# Altium schematic sheet RF_T-Line.SchDoc
size A; SheetNumber: 14; SheetTotal: 15
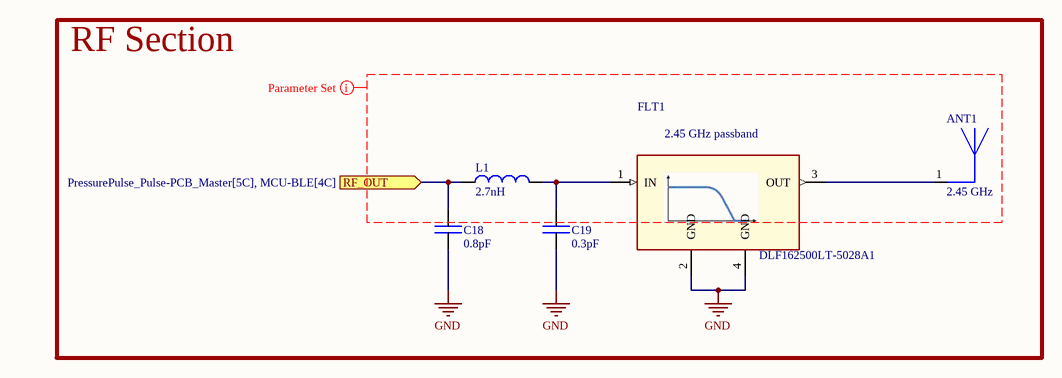
[diagram p0: RF_T-Line.SchDoc]

## Parts
ANT1  Center Frequency: 2.45 GHz  [ANTC5220X130N]  (hidden comment: CHIP ANTENNA)
C18  value 0.8pF  [0603C]  (hidden comment: CAP)
C19  value 0.3pF  [0402C]  (hidden comment: CAP)
FLT1  DLF162500LT-5028A1  [DLF-4_1P6X0P8]
L1  value 2.7nH  [0402L]  (hidden comment: IND)

## Blocks framed on the sheet
RF Section: ANT1 C18 C19 FLT1 L1

## Ports
RF_OUT (in, see PressurePulse_Pulse-PCB_Master[5C], MCU-BLE[4C])

## Nets
GND: C18.1 C19.1 FLT1.2(GND) FLT1.4(GND)
RF_OUT: C18.2 L1.1 ; port RF_OUT
NetANT1_1: ANT1.1 FLT1.3(OUT)
NetC19_2: C19.2 FLT1.1(IN) L1.2

## Layout directives
net class RF: (no net found under the mark)

## Notes on the sheet
- (in symbol 2.45GHz LPF) 2.45 GHz passband

## Library data of the parts
ANT1 = CHIP ANTENNA: MFR: Pulse Electronics; MFR PN: ANT7020LL05R2400A; Value: DNS; JLCPCB PN: *
C18 C19 = CAP: Capacitor; MFR: *; MFR PN: *
  C18: JLCPCB PN: C507057; Footprint: 0603
  C19: JLCPCB PN: C2986289; Footprint: *
FLT1 = 2.45GHz LPF: RF FILTER LOW PASS 2.45GHZ 0603; MFR: TDK; MFR PN: DLF162500LT-5028A1; Value: DLF162500LT-5028A1; JLCPCB PN: C531364
L1 = IND: INDUCTOR; JLCPCB PN: C963981; Footprint: *